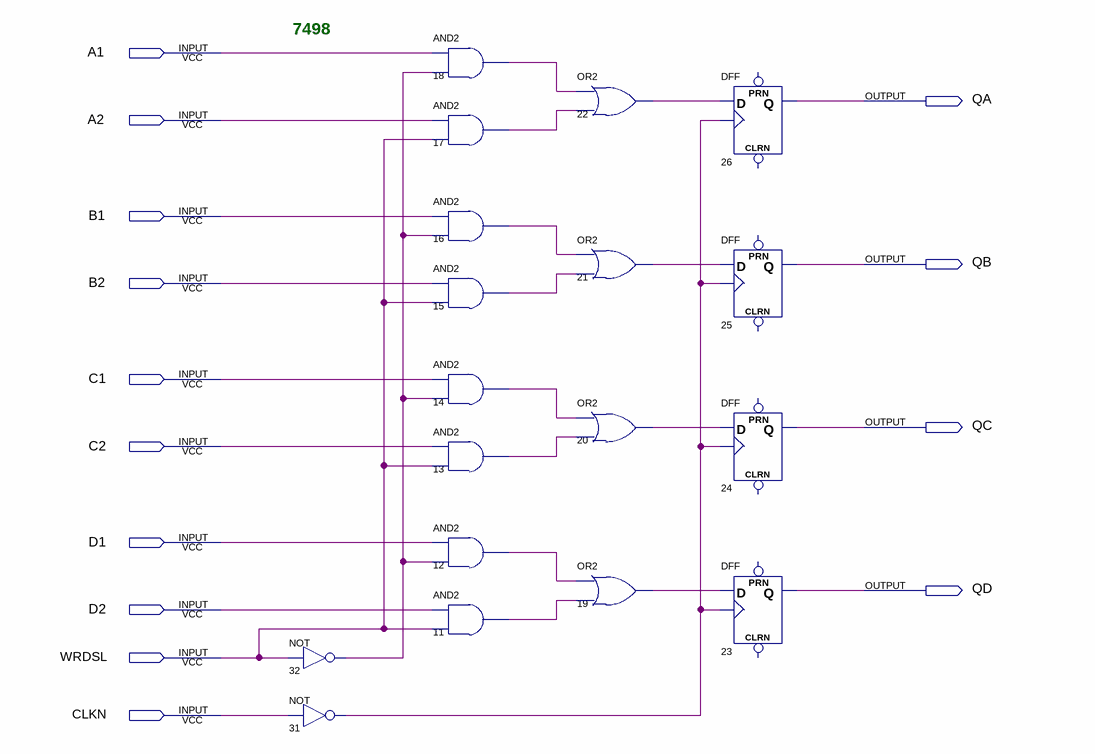
[diagram p0: schematic sheet]
// Quartus schematic 7498.bdf as structural Verilog: 18 symbols, 14 pins
module \7498  (
  input  A1,
  input  A2,
  input  B1,
  input  B2,
  input  C1,
  input  C2,
  input  D1,
  input  D2,
  input  WRDSL,
  input  CLKN,
  output QA,
  output QB,
  output QC,
  output QD
);

  wire n11_out, n12_out, n13_out, n14_out, n15_out, n16_out, n17_out, n18_out, n19_out, n20_out, n21_out,
       n22_out, n31_out, n32_out;

  not u_32 (n32_out, WRDSL);
  not u_31 (n31_out, CLKN);
  and u_18 (n18_out, A1, n32_out);
  and u_17 (n17_out, A2, WRDSL);
  and u_16 (n16_out, B1, n32_out);
  and u_15 (n15_out, B2, WRDSL);
  and u_14 (n14_out, C1, n32_out);
  and u_13 (n13_out, C2, WRDSL);
  and u_12 (n12_out, D1, n32_out);
  and u_11 (n11_out, D2, WRDSL);
  or u_22 (n22_out, n18_out, n17_out);
  or u_21 (n21_out, n16_out, n15_out);
  or u_20 (n20_out, n14_out, n13_out);
  or u_19 (n19_out, n12_out, n11_out);
  DFF u_26 (.CLK(n31_out), .D(n22_out), .Q(QA));  // open: CLRN, PRN
  DFF u_25 (.CLK(n31_out), .D(n21_out), .Q(QB));  // open: CLRN, PRN
  DFF u_24 (.CLK(n31_out), .D(n20_out), .Q(QC));  // open: CLRN, PRN
  DFF u_23 (.CLK(n31_out), .D(n19_out), .Q(QD));  // open: CLRN, PRN

  // Notes on the sheet:
  //   7498
endmodule
